# Altium project PCB_ev1527.PrjPCB
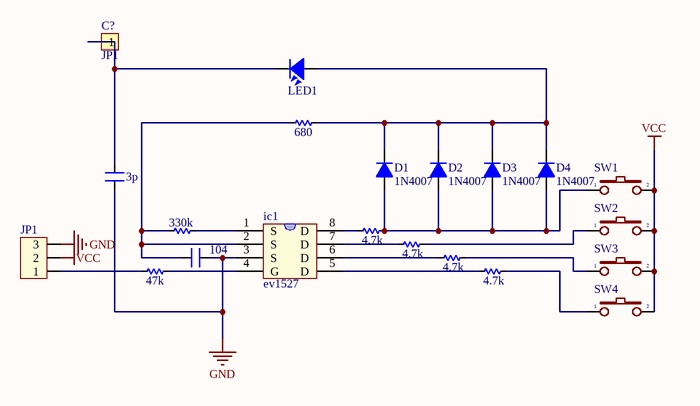
[diagram p0: NGUYENLY1527.SchDoc]
1 sheet, 21 parts. Net scope: global (net labels, ports and power ports of the same name join across sheets).
Board file: MACHIN1527.PcbDoc

## Sheet NGUYENLY1527.SchDoc
size A

### Parts
1  330k  [RES-1/2W]
2  680  [RES-1/2W]
3  47k  [RES-1/2W]
3p  (no value)  [CN1]
4  4.7k  [RES-1/2W]
5  4.7k  [RES-1/2W]
7  4.7k  [RES-1/2W]
8  4.7k  [RES-1/2W]
104  (no value)  [CN1]
C?  JP1  [JP1-D1T]
D1  1N4007  [D2A]
D2  1N4007  [D2A]
D3  1N4007  [D2A]
D4  1N4007  [D2A]
ic1  ev1527  [SO-8]
JP1  JP3  [CON3]  (value not drawn)
LED1  LED  [LED-3MM-YELLOW]  (value not drawn)
SW1  (no value)  [SW2]
SW2  (no value)  [SW2]
SW3  (no value)  [SW2]
SW4  (no value)  [SW2]

### Nets
GND: 3p.1 104.1 ic1.3(S) JP1.3
VCC: JP1.2 SW1.2 SW2.2 SW3.2 SW4.2
Net1_1: 1.1 ic1.1(S)
Net1_2: 1.2 2.2 104.2 ic1.2(S)
Net2_1: 2.1 D1.2(K) D2.2(K) D3.2(K) D4.2(K) LED1.1
Net3_1: 3.1 JP1.1
Net3_2: 3.2 ic1.4(G)
Net3p_2: 3p.2 C?.1 LED1.2
Net4_1: 4.1 ic1.8(D)
Net4_2: 4.2 D1.1(A) D2.1(A) D3.1(A) D4.1(A) SW1.1
Net5_1: 5.1 ic1.7(D)
Net5_2: 5.2 SW2.1
Net7_1: 7.1 ic1.6(D)
Net7_2: 7.2 SW3.1
Net8_1: 8.1 ic1.5(D)
Net8_2: 8.2 SW4.1

### Library data of the parts
1-5 7 8 = Res: Manufacturer: Generic Components; Class: Passive; SubClass: R; Published: 08/06/2000; Publisher: Altium Hobart Technology Centre
3p 104 = CN1: Cap np  1pF - 472pF; Value: 100pF
C? = JP1: WR-PHD 2.54 mm Angled Socket Header; Manufacturer: W¨¹rth Elektronik eiSos GmbH; partNo: 613002143121; ComponentLink1 Description: Manufacturer; ComponentLink2 Description: Datasheet; NoPins: 02; Created Date: 29 March 2013; ComponentLink1URL: http://www.we-online.com; ComponentLink2URL: http://katalog.we-online.de/em/datasheet/6130xx143121.pdf; Created by: Karrer Zheng
D1-D4 = D1A: Diode 1A; Value: 1N4007
ic1 = FDS4435A: P-Channel Logic Level PowerTrench MOSFET; Value: FDS4435
JP1 = Con3: Connector 3; Value: Connector 3
LED1 = LED: LED Single colour Green and Red; Value: LED 3 ly Single Colour
SW1-SW4 = SW2: Switch button 2 pin; Value: SW chip 2 pin